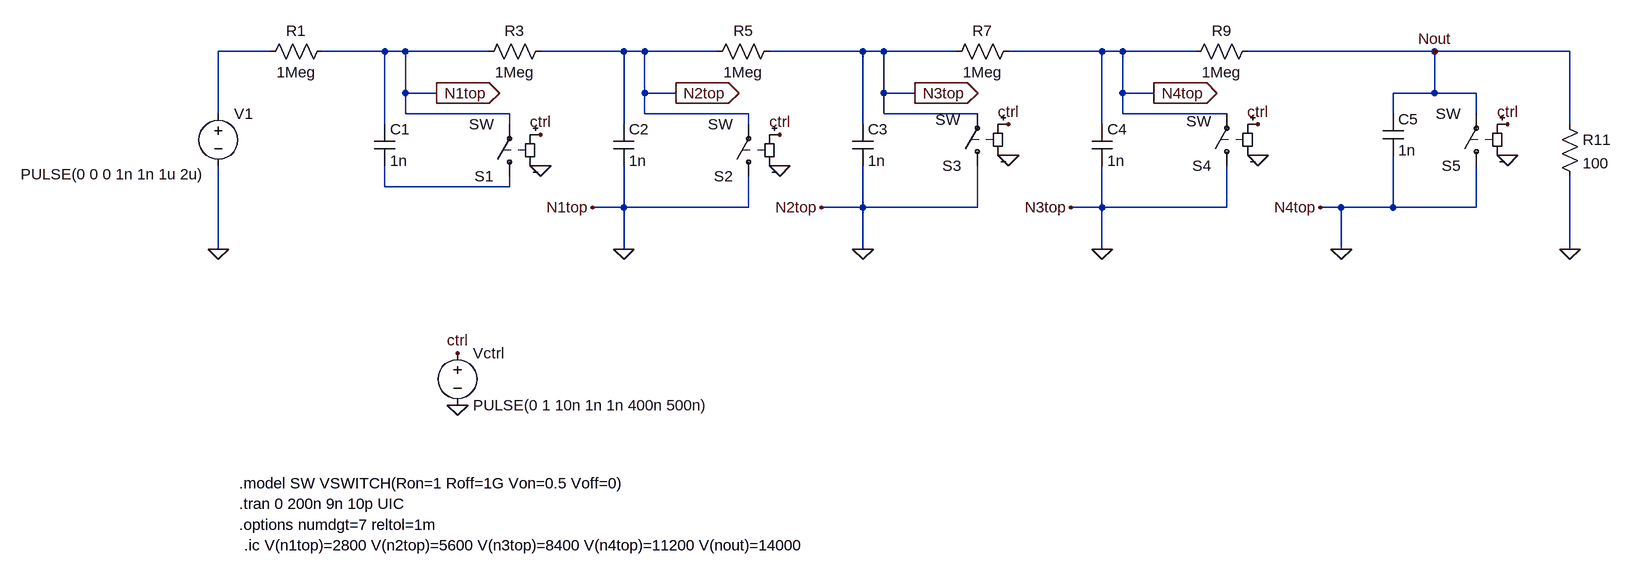
[diagram p0: schematic Sim_Marx.asc]
Sim_Marx.asc, the LTspice schematic file:
Version 4.1
SHEET 1 2228 872
WIRE 160 16 80 16
WIRE 336 16 240 16
WIRE 368 16 336 16
WIRE 496 16 368 16
WIRE 704 16 576 16
WIRE 736 16 704 16
WIRE 848 16 736 16
WIRE 1072 16 928 16
WIRE 1104 16 1072 16
WIRE 1216 16 1104 16
WIRE 1440 16 1296 16
WIRE 1472 16 1440 16
WIRE 1584 16 1472 16
WIRE 1952 16 1664 16
WIRE 2160 16 1952 16
WIRE 368 80 368 16
WIRE 416 80 368 80
WIRE 736 80 736 16
WIRE 784 80 736 80
WIRE 1104 80 1104 16
WIRE 1152 80 1104 80
WIRE 1472 80 1472 16
WIRE 1520 80 1472 80
WIRE 1952 80 1952 16
WIRE 1952 80 1888 80
WIRE 2016 80 1952 80
WIRE 80 112 80 16
WIRE 368 112 368 80
WIRE 528 112 368 112
WIRE 736 112 736 80
WIRE 896 112 736 112
WIRE 1104 112 1104 80
WIRE 1248 112 1104 112
WIRE 1472 112 1472 80
WIRE 1632 112 1472 112
WIRE 1888 112 1888 80
WIRE 2016 112 2016 80
WIRE 336 128 336 16
WIRE 528 128 528 112
WIRE 704 128 704 16
WIRE 896 128 896 112
WIRE 1072 128 1072 16
WIRE 1440 128 1440 16
WIRE 2160 128 2160 16
WIRE 336 224 336 192
WIRE 528 224 528 208
WIRE 528 224 336 224
WIRE 704 256 704 192
WIRE 704 256 656 256
WIRE 896 256 896 208
WIRE 896 256 704 256
WIRE 1072 256 1072 192
WIRE 1072 256 1008 256
WIRE 1248 256 1248 192
WIRE 1248 256 1072 256
WIRE 1440 256 1440 192
WIRE 1440 256 1392 256
WIRE 1632 256 1632 192
WIRE 1632 256 1440 256
WIRE 1808 256 1776 256
WIRE 1888 256 1888 176
WIRE 1888 256 1808 256
WIRE 2016 256 2016 192
WIRE 2016 256 1888 256
WIRE 80 320 80 192
WIRE 704 320 704 256
WIRE 1072 320 1072 256
WIRE 1440 320 1440 256
WIRE 1808 320 1808 256
WIRE 2160 320 2160 208
FLAG 416 80 N1top
IOPIN 416 80 Out
FLAG 80 320 0
FLAG 656 256 N1top
FLAG 1152 80 N3top
IOPIN 1152 80 Out
FLAG 1392 256 N3top
FLAG 784 80 N2top
IOPIN 784 80 Out
FLAG 1008 256 N2top
FLAG 1520 80 N4top
IOPIN 1520 80 Out
FLAG 1776 256 N4top
FLAG 2160 320 0
FLAG 448 480 ctrl
FLAG 576 144 ctrl
FLAG 448 560 0
FLAG 576 192 0
FLAG 1296 176 0
FLAG 1680 176 0
FLAG 944 144 ctrl
FLAG 1296 128 ctrl
FLAG 1680 128 ctrl
FLAG 1952 16 Nout
FLAG 2064 128 ctrl
FLAG 2064 176 0
FLAG 704 320 0
FLAG 1072 320 0
FLAG 1440 320 0
FLAG 1808 320 0
FLAG 944 192 0
SYMBOL voltage 80 96 R0
WINDOW 3 -304 109 Left 2
WINDOW 123 0 0 Left 0
WINDOW 39 0 0 Left 0
SYMATTR InstName V1
SYMATTR Value PULSE(0 0 0 1n 1n 1u 2u)
SYMBOL res 144 32 R270
WINDOW 0 32 56 VTop 2
WINDOW 3 0 56 VBottom 2
SYMATTR InstName R1
SYMATTR Value 1Meg
SYMBOL cap 320 128 R0
SYMATTR InstName C1
SYMATTR Value 1n
SYMBOL res 480 32 R270
WINDOW 0 32 56 VTop 2
WINDOW 3 0 56 VBottom 2
SYMATTR InstName R3
SYMATTR Value 1Meg
SYMBOL cap 688 128 R0
SYMATTR InstName C2
SYMATTR Value 1n
SYMBOL res 832 32 R270
WINDOW 0 32 56 VTop 2
WINDOW 3 0 56 VBottom 2
SYMATTR InstName R5
SYMATTR Value 1Meg
SYMBOL cap 1056 128 R0
SYMATTR InstName C3
SYMATTR Value 1n
SYMBOL res 1200 32 R270
WINDOW 0 32 56 VTop 2
WINDOW 3 0 56 VBottom 2
SYMATTR InstName R7
SYMATTR Value 1Meg
SYMBOL cap 1424 128 R0
SYMATTR InstName C4
SYMATTR Value 1n
SYMBOL res 1568 32 R270
WINDOW 0 32 56 VTop 2
WINDOW 3 0 56 VBottom 2
SYMATTR InstName R9
SYMATTR Value 1Meg
SYMBOL cap 1872 112 R0
SYMATTR InstName C5
SYMATTR Value 1n
SYMBOL sw 528 224 R180
SYMATTR InstName S1
SYMBOL res 2144 112 R0
SYMATTR InstName R11
SYMATTR Value 100
SYMBOL voltage 448 464 R0
WINDOW 123 0 0 Left 0
WINDOW 39 0 0 Left 0
SYMATTR InstName Vctrl
SYMATTR Value PULSE(0 1 10n 1n 1n 400n 500n)
SYMBOL sw 896 224 R180
SYMATTR InstName S2
SYMBOL sw 1248 208 R180
WINDOW 3 26 87 Left 2
SYMATTR InstName S3
SYMBOL sw 1632 208 R180
WINDOW 3 24 85 Left 2
SYMATTR InstName S4
SYMBOL sw 2016 208 R180
SYMATTR InstName S5
TEXT 112 680 Left 2 !.model SW VSWITCH(Ron=1 Roff=1G Von=0.5 Voff=0)
TEXT 112 712 Left 2 !.tran 0 200n 9n 10p UIC
TEXT 112 744 Left 2 !.options numdgt=7 reltol=1m
TEXT 120 776 Left 2 !.ic V(n1top)=2800 V(n2top)=5600 V(n3top)=8400 V(n4top)=11200 V(nout)=14000

The netlist it stands for:
* Sim_Marx.asc
V1 N001 0 PULSE(0 0 0 1n 1n 1u 2u)
R1 N001 0 1Meg
C1 0 N002 1n
R3 0 0 1Meg
C2 0 0 1n
R5 0 0 1Meg
C3 0 0 1n
R7 0 0 1Meg
C4 0 0 1n
R9 0 Nout 1Meg
C5 Nout 0 1n
S1 N002 0 ctrl 0 SW
R11 Nout 0 100
Vctrl ctrl 0 PULSE(0 1 10n 1n 1n 400n 500n)
S2 0 0 ctrl 0 SW
S3 0 0 ctrl 0 SW
S4 0 0 ctrl 0 SW
S5 0 Nout ctrl 0 SW
.model SW VSWITCH(Ron=1 Roff=1G Von=0.5 Voff=0)
.tran 0 200n 9n 10p UIC
.options numdgt=7 reltol=1m
.ic V(n1top)=2800 V(n2top)=5600 V(n3top)=8400 V(n4top)=11200 V(nout)=14000
.backanno
.end